# Altium schematic sheet mcu.SchDoc: Abacus main PCB - MCU
size A4; DrawnBy: Posheng Cheng; SheetNumber: 2; SheetTotal: 3
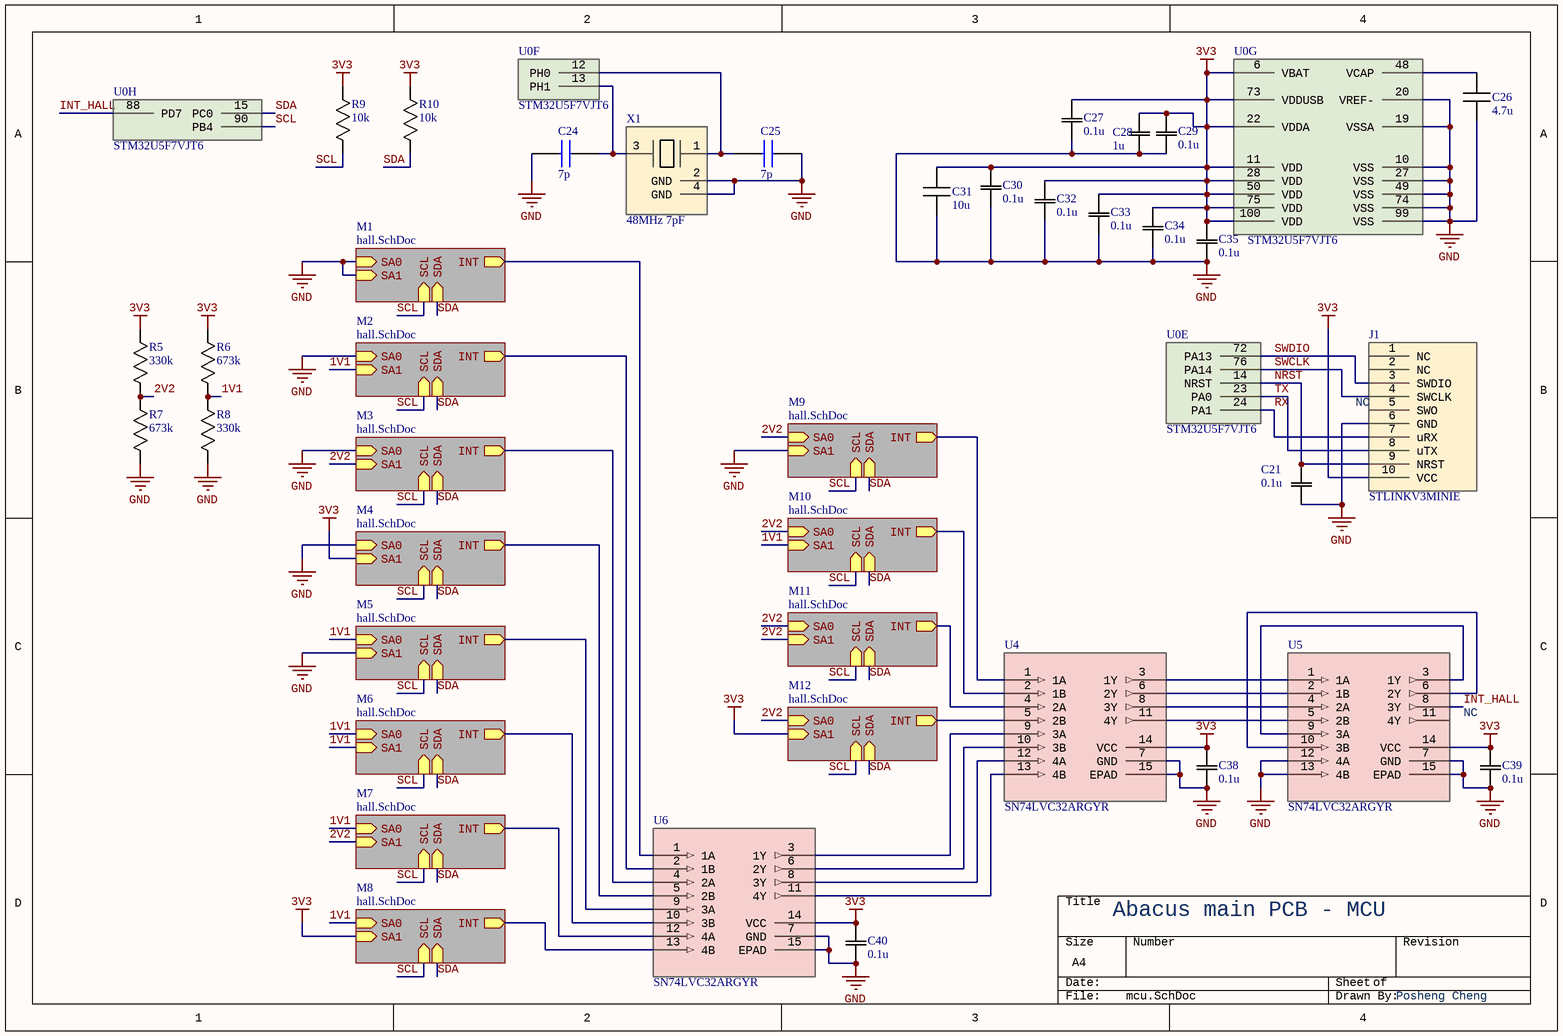
[diagram p0: mcu.SchDoc]

## Parts
(Parts that share a designator on the sheet are numbered #1, #2 ... from top to bottom, then left to right.)
C21  0.1u  [CAP_CC0201_YAG]
C24  7p  [CAPC0603X33N]
C25  7p  [CAPC0603X33N]
C26  4.7u  [CAPC17595_87N_KEM]
C27  0.1u  [CAP_CC0201_YAG]
C28  1u  [CAP_CC0201_YAG]
C29  0.1u  [CAP_CC0201_YAG]
C30  0.1u  [CAP_CC0201_YAG]
C31  10u  [CAPC17595_87N_KEM]
C32  0.1u  [CAP_CC0201_YAG]
C33  0.1u  [CAP_CC0201_YAG]
C34  0.1u  [CAP_CC0201_YAG]
C35  0.1u  [CAP_CC0201_YAG]
C38  0.1u  [CAP_CC0201_YAG]
C39  0.1u  [CAP_CC0201_YAG]
C40  0.1u  [CAP_CC0201_YAG]
J1  STLINKV3MINIE  [009159010061911]
R5  330k  [RC0603N_YAG]
R6  673k  [RC0603N_YAG]
R7  673k  [RC0603N_YAG]
R8  330k  [RC0603N_YAG]
R9  10k  [RC0603N_PAN]
R10  10k  [RC0603N_PAN]
U0#1  STM32U5F7VJT6  [QFP50P1600X1600X160-100N]  (part F of 6)
U0#2  STM32U5F7VJT6  [QFP50P1600X1600X160-100N]  (part G of 7)
U0#3  STM32U5F7VJT6  [QFP50P1600X1600X160-100N]  (part H of 8)
U0#4  STM32U5F7VJT6  [QFP50P1600X1600X160-100N]  (part E of 5)
U4  SN74LVC32ARGYR  [RGY14_2P05X2P05]
U5  SN74LVC32ARGYR  [RGY14_2P05X2P05]
U6  SN74LVC32ARGYR  [RGY14_2P05X2P05]
X1  48MHz 7pF  [ECS-480-7-33B2-CKM-TR3]

## Sub-sheets
M1 = hall.SchDoc: SA0 (in), SA1 (in), SCL (in), SDA (in), INT (out)
M2 = hall.SchDoc: SA0 (in), SA1 (in), SCL (in), SDA (in), INT (out)
M3 = hall.SchDoc: SA0 (in), SA1 (in), SCL (in), SDA (in), INT (out)
M4 = hall.SchDoc: SA0 (in), SA1 (in), SCL (in), SDA (in), INT (out)
M5 = hall.SchDoc: SA0 (in), SA1 (in), SCL (in), SDA (in), INT (out)
M6 = hall.SchDoc: SA0 (in), SA1 (in), SCL (in), SDA (in), INT (out)
M7 = hall.SchDoc: SA0 (in), SA1 (in), SCL (in), SDA (in), INT (out)
M8 = hall.SchDoc: SA0 (in), SA1 (in), SCL (in), SDA (in), INT (out)
M9 = hall.SchDoc: SA0 (in), SA1 (in), SCL (in), SDA (in), INT (out)
M10 = hall.SchDoc: SA0 (in), SA1 (in), SCL (in), SDA (in), INT (out)
M11 = hall.SchDoc: SA0 (in), SA1 (in), SCL (in), SDA (in), INT (out)
M12 = hall.SchDoc: SA0 (in), SA1 (in), SCL (in), SDA (in), INT (out)

## Nets
3V3: C27.2 C28.2 C29.2 C30.2 C31.2 C32.2 C33.2 C34.2 C35.2 C38.1 C39.1 C40.1 J1.10(VCC) R5.1 R6.1 R9.1 R10.2 U0#2.6(VBAT) U0#2.11(VDD) U0#2.22(VDDA) U0#2.28(VDD) U0#2.50(VDD) U0#2.73(VDDUSB) U0#2.75(VDD) U0#2.100(VDD) U4.14(VCC) U5.14(VCC) U6.14(VCC) ; sheet M12/SA1, sheet M4/SA1, sheet M8/SA1
GND: C21.1 C24.1 C25.2 C26.1 C27.1 C28.1 C29.1 C30.1 C31.1 C32.1 C33.1 C34.1 C35.1 C38.2 C39.2 C40.2 J1.6(GND) R7.2 R8.2 U0#2.10(VSS) U0#2.19(VSSA) U0#2.20(VREF-) U0#2.27(VSS) U0#2.49(VSS) U0#2.74(VSS) U0#2.99(VSS) U4.7(GND) U4.15(EPAD) U5.7(GND) U5.12(4A) U5.13(4B) U5.15(EPAD) U6.7(GND) U6.15(EPAD) X1.2(GND) X1.4(GND) ; sheet M9/SA1, sheet M1/SA0, sheet M1/SA1, sheet M2/SA0, sheet M3/SA0, sheet M4/SA0, sheet M5/SA1
1V1: R6.2 R8.1 ; sheet M10/SA1, sheet M2/SA1, sheet M5/SA0, sheet M6/SA0, sheet M6/SA1, sheet M7/SA0, sheet M8/SA0
2V2: R5.2 R7.1 ; sheet M9/SA0, sheet M10/SA0, sheet M11/SA0, sheet M11/SA1, sheet M12/SA0, sheet M3/SA1, sheet M7/SA1
INT_HALL: U0#3.88(PD7) U5.8(3Y)
NRST: C21.2 J1.9(NRST) U0#4.14(NRST)
RX: J1.7(uRX) U0#4.24(PA1)
SCL: R9.2 U0#3.90(PB4) ; sheet M9/SCL, sheet M10/SCL, sheet M11/SCL, sheet M12/SCL, sheet M1/SCL, sheet M2/SCL, sheet M3/SCL, sheet M4/SCL, sheet M5/SCL, sheet M6/SCL, sheet M7/SCL, sheet M8/SCL
SDA: R10.1 U0#3.15(PC0) ; sheet M9/SDA, sheet M10/SDA, sheet M11/SDA, sheet M12/SDA, sheet M1/SDA, sheet M2/SDA, sheet M3/SDA, sheet M4/SDA, sheet M5/SDA, sheet M6/SDA, sheet M7/SDA, sheet M8/SDA
SWCLK: J1.4(SWCLK) U0#4.76(PA14)
SWDIO: J1.3(SWDIO) U0#4.72(PA13)
TX: J1.8(uTX) U0#4.23(PA0)
NetC24_2: C24.2 U0#1.13(PH1) X1.3
NetC25_1: C25.1 U0#1.12(PH0) X1.1
NetC26_2: C26.2 U0#2.48(VCAP)
NetU4_1: U4.1(1A) ; sheet M9/INT
NetU4_2: U4.2(1B) ; sheet M10/INT
NetU4_3: U4.3(1Y) U5.1(1A)
NetU4_4: U4.4(2A) ; sheet M11/INT
NetU4_5: U4.5(2B) ; sheet M12/INT
NetU4_6: U4.6(2Y) U5.2(1B)
NetU4_8: U4.8(3Y) U5.4(2A)
NetU4_9: U4.9(3A) U6.3(1Y)
NetU4_10: U4.10(3B) U6.6(2Y)
NetU4_11: U4.11(4Y) U5.5(2B)
NetU4_12: U4.12(4A) U6.8(3Y)
NetU4_13: U4.13(4B) U6.11(4Y)
NetU5_3: U5.3(1Y) U5.9(3A)
NetU5_6: U5.6(2Y) U5.10(3B)
NetU6_1: U6.1(1A) ; sheet M1/INT
NetU6_2: U6.2(1B) ; sheet M2/INT
NetU6_4: U6.4(2A) ; sheet M3/INT
NetU6_5: U6.5(2B) ; sheet M4/INT
NetU6_9: U6.9(3A) ; sheet M5/INT
NetU6_10: U6.10(3B) ; sheet M6/INT
NetU6_12: U6.12(4A) ; sheet M7/INT
NetU6_13: U6.13(4B) ; sheet M8/INT

Not connected (* = marked no-connect by the designer): J1 1(NC) 2(NC) 5(SWO); U5 11(4Y)

## Notes on the sheet
- (near J1) NC
- NC

## Library data of the parts
C21 C27 C29 C30 C32-C35 = CMP-001-00086-1: Description; Manufacturer_Name: Yageo; Copyright: Copyright (C) 2025 Ultra Librarian. All rights reserved.; Design Item ID: CC0201KRX5R7BB104; Manufacturer_Part_Number: CC0201KRX5R7BB104; Source: CC0201KRX5R7BB104.SchLib
C24 C25 = CBR02C709B5GAC: CBR-SMD RF C0G, Ceramic, 7 pF, +/-0.1 pF, 50 VDC, 125 VDC, 125C, -55C, C0G, SMD, Fixed, RF, Ultra High Q, Low ESR, Class I, 0.18 % , 10 GOhms, 540, 0.3 mg, 0201, 0.6mm, 0.3mm, 0.3mm, 0.15mm, 15000, 78  Weeks, 120; Manufacturer_Name: KEMET; Geometry.Height: 0.33mm; Manufacturer_Part_Number: CBR02C709B5GAC; Mouser Part Number: *; Mouser Price/Stock: *; Arrow Part Number: *; Arrow Price/Stock: *; Datasheet Link: http://www.kemet.com/Lists/ProductCatalog/Attachments/490/KEM_C1030_CBR_SMD.pdf
C26 = C0603C475K8PACTU: C0603C475K8PACTU 4.7uF 4.7 uF, 10%, 10 VDC, X5R; Manufacturer_Part_Number: C0603C475K8PACTU
C28 = CMP-001-00084-1: No Description Available; Manufacturer_Name: Yageo; Design Item ID: CC0201MRX5R5BB105; Manufacturer_Part_Number: CC0201MRX5R5BB105; Source: CC0201MRX5R5BB105.SchLib; Copyright: Copyright (C) 2025 Ultra Librarian. All rights reserved.
C31 = CC0603KRX5R5BB106: CC0603KRX5R5BB106 10 uF, 10%, 6.3 VDC, X5R; Manufacturer_Part_Number: CC0603KRX5R5BB106
C38-C40 = CMP-001-00086-2: Description; Manufacturer_Part_Number: CC0201KRX5R7BB104; Manufacturer_Name: Yageo; Copyright: Copyright (C) 2025 Ultra Librarian. All rights reserved.; Source: CC0201KRX5R7BB104.SchLib; Design Item ID: CC0201KRX5R7BB104
J1 = 009159010061911: KYOCERA-AVX 009159010061911
R5 R8 = RT0603BRD07330KL: No Description Available; Manufacturer_Name: Yageo; Copyright: Copyright (C) 2025 Ultra Librarian. All rights reserved.; Manufacturer_Part_Number: RT0603BRD07330KL
R6 R7 = RT0603BRE07673KL: No Description Available; Manufacturer_Name: Yageo; Copyright: Copyright (C) 2025 Ultra Librarian. All rights reserved.; Manufacturer_Part_Number: RT0603BRE07673KL
R9 R10 = RC0201FR-1310KL: YAGEO, RT, Thin Film, SMD Chip, 10k Ohms, 1%, 0603 / 1608; Copyright: Copyright (C) 2025 Ultra Librarian. All rights reserved.; Manufacturer_Name: YAGEO; Manufacturer_Part_Number: RC0201FR-1310KL
U0#1-U0#4 = STM32U5F7VJT6: Advanced Graphics and Ultra Low Power  CortexM-33 with Trustzone, NEOCHROM VG GPU, 160MHZ, with 3 MBSRAM and 4M of Flash.; Manufacturer_Name: STMicroelectronics; Geometry.Height: 1.6mm; Manufacturer_Part_Number: STM32U5F7VJT6; Mouser Part Number: 511-STM32U5F7VJT6; Mouser Price/Stock: https://www.mouser.co.uk/ProductDetail/STMicroelectronics/STM32U5F7VJT6?qs=HoCaDK9Nz5e1ZGsW1DPWFA%3D%3D; Arrow Part Number: STM32U5F7VJT6; Arrow Price/Stock: https://www.arrow.com/en/products/stm32u5f7vjt6/stmicroelectronics?region=nac; Datasheet Link: https://www.st.com/resource/en/datasheet/stm32u5f7vj.pdf
U4-U6 = SN74LVC32ARGYR: Four-channel, two-input, 1.65V to 3.6V 24mA drive strength OR gate 14-VQFN -40 to 125; Manufacturer_Name: Texas Instruments; Copyright: Copyright (C) 2025 Ultra Librarian. All rights reserved.; Manufacturer_Part_Number: SN74LVC32ARGYR; RefDes: RefDes; Type: Type
X1 = ECS-480-7-33B2-CKM-TR3: Manufacturer_Part_Number: ECS-480-7-33B2-CKM-TR3